# Altium schematic sheet Лист 1.SchDoc
size 420 x 297 mm; Scale: 1:1; Разраб.: Брюханов; Обозначение документа: АЛ.001.001 Э3; Номер листа: 1; Общее количество листов: 5; Масштаб: 1:1; Наименование организации: AlenLab; Наименование изделия 1: Плата; Наименование изделия 2: управления; Наименование изделия 3: Схема электрическая принципиальная; Нач. отд.: Нач. отд.
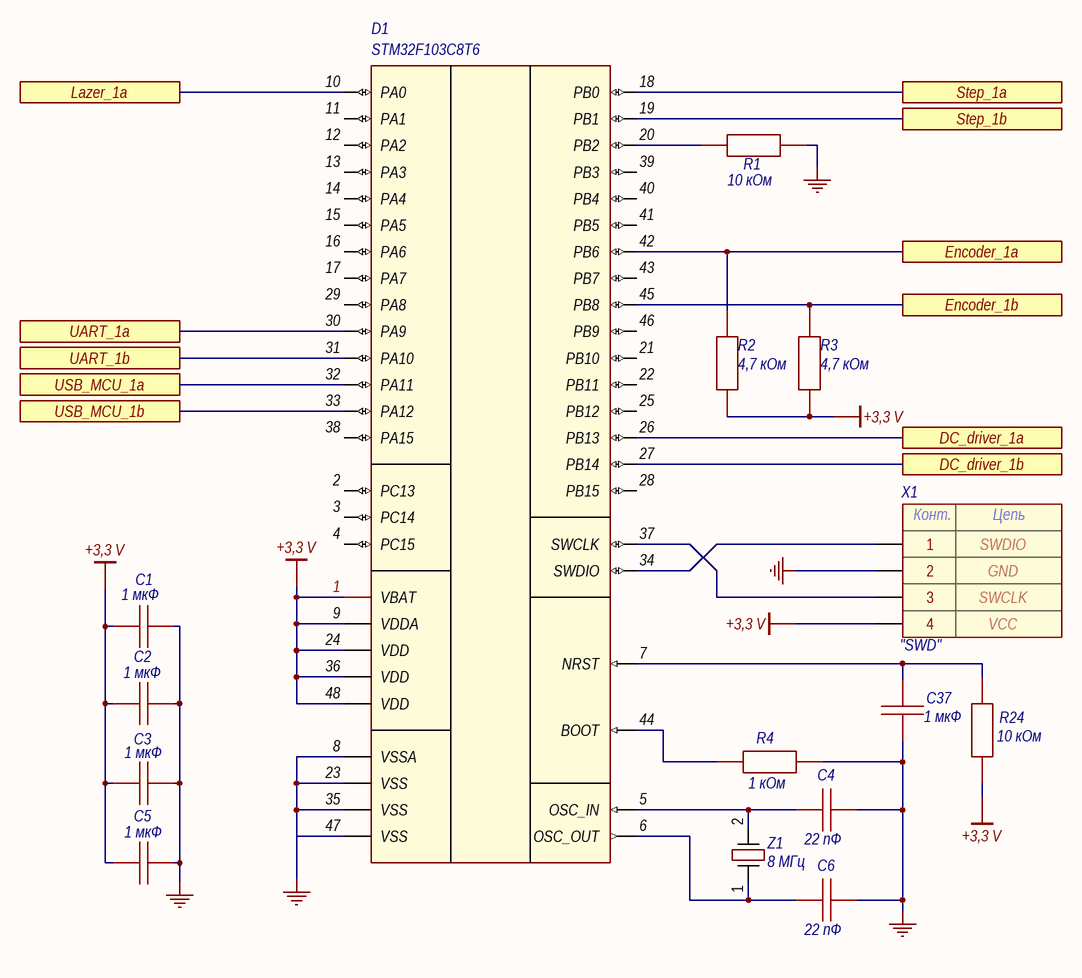
[diagram p0: Лист 1.SchDoc]

## Parts
C1  value 1 мкФ  [CAP: 0805]
C2  value 1 мкФ  [CAP: 0805]
C3  value 1 мкФ  [CAP: 0805]
C4  value 22 пФ  [CAP: 0805]
C5  value 1 мкФ  [CAP: 0805]
C6  value 22 пФ  [CAP: 0805]
C37  value 1 мкФ  [CAP: 0805]
D1  (no value)  [48-LQFP]
R1  value 10 кОм  [RES: 0805]
R2  value 4,7 кОм  [RES: 0805]
R3  value 4,7 кОм  [RES: 0805]
R4  value 1 кОм  [RES: 0805]
R24  value 10 кОм  [RES: 0805]
X1  CommentText: "SWD"  [CON: PLS-4]
Z1  8 МГц  [OSC: 5032 2 pin]

## Ports
DC_driver_1a, DC_driver_1b, Encoder_1a, Encoder_1b, Lazer_1a, Step_1a, Step_1b, UART_1a, UART_1b, USB_MCU_1a, USB_MCU_1b

## Nets
+3,3 V: C1.1 C2.1 C3.1 C5.1 D1.1(VBAT) D1.9(VDDA) D1.24(VDD) D1.36(VDD) D1.48(VDD) R2.1 R3.1 R24.1 X1.4
GND: C1.2 C2.2 C3.2 C4.1 C5.2 C6.1 C37.1 D1.8(VSSA) D1.23(VSS) D1.35(VSS) D1.47(VSS) R1.2 R4.2 X1.2
DC_driver_1a: D1.26(PB13) ; port DC_driver_1a
DC_driver_1b: D1.27(PB14) ; port DC_driver_1b
Encoder_1a: D1.42(PB6) R2.2 ; port Encoder_1a
Encoder_1b: D1.45(PB8) R3.2 ; port Encoder_1b
Lazer_1a: D1.10(PA0) ; port Lazer_1a
Step_1a: D1.18(PB0) ; port Step_1a
Step_1b: D1.19(PB1) ; port Step_1b
UART_1a: D1.30(PA9) ; port UART_1a
UART_1b: D1.31(PA10) ; port UART_1b
USB_MCU_1a: D1.32(PA11) ; port USB_MCU_1a
USB_MCU_1b: D1.33(PA12) ; port USB_MCU_1b
NetC4_2: C4.2 D1.5(OSC_IN) Z1.2
NetC6_2: C6.2 D1.6(OSC_OUT) Z1.1
NetC37_2: C37.2 D1.7(NRST) R24.2
NetD1_20: D1.20(PB2) R1.1
NetD1_34: D1.34(SWDIO) X1.1
NetD1_37: D1.37(SWCLK) X1.3
NetD1_44: D1.44(BOOT) R4.1

Not connected (* = marked no-connect by the designer): D1 2(PC13) 3(PC14) 4(PC15) 11(PA1) 12(PA2) 13(PA3) 14(PA4) 15(PA5) 16(PA6) 17(PA7) 21(PB10) 22(PB11) 25(PB12) 28(PB15) 29(PA8) 38(PA15) 39(PB3) 40(PB4) 41(PB5) 43(PB7) 46(PB9)

## Notes on the sheet
- Перв. примен.
- Справ. №
- Подп. и дата
- Инв. № дубл.
- Взам. инв. №
- Разраб.
- Изм.
- Лист
- № докум.
- Подп.
- Дата
- Лит.
- Масса
- Масштаб
- Пров.
- Т.контр.
- Листов
- Инв. № подл.
- Утв.
- Н.контр.
- Копировал
- Формат А3
- (in symbol PLS-4) Конт.; Цепь

## Library data of the parts
C1-C3 C5 = Ceramic_0805: Manufacturer: Yageo; PartNumber: CC0805KRX7R7BB104; ValueManufacturerPartNumber: Ceramic capacitor, 1 мкФ, X7R, ±10%, 16V, 0805, -55...+125°C; TypeCapacitor: Ceramic capacitor; Tolerance: ±10%; TypeDielectric: X7R; Voltage: 16V; Package: 0805; HelpURL: https://www.digikey.com/product-detail/en/yageo/CC0805KRX7R7BB104/311-1142-1-ND/303052; Temperature: -55...+125°C
C4 C6 = Ceramic_0805: Manufacturer: Yageo; PartNumber: CC0805KRX7R7BB104; ValueManufacturerPartNumber: Ceramic capacitor, 22 пФ, X7R, ±10%, 16V, 0805, -55...+125°C; TypeCapacitor: Ceramic capacitor; Tolerance: ±10%; TypeDielectric: X7R; Voltage: 16V; Package: 0805; HelpURL: https://www.digikey.com/product-detail/en/yageo/CC0805KRX7R7BB104/311-1142-1-ND/303052; Temperature: -55...+125°C
C37 = Ceramic_0805: Manufacturer: Yageo; PartNumber: CC0805KRX7R7BB104; ValueManufacturerPartNumber: Ceramic capacitor, 1 мкФ, X7R, ±10%, 16 В, 0805, -55...+125°C; TypeCapacitor: Ceramic capacitor; Tolerance: ±10%; TypeDielectric: X7R; Voltage: 16 В; Package: 0805; HelpURL: https://www.digikey.com/product-detail/en/yageo/CC0805KRX7R7BB104/311-1142-1-ND/303052; Temperature: -55...+125°C
D1 = STM32F103C8T6: Cortex-M3; Manufacturer: STMicroelectronics; ValueManufacturerPartNumber: IC microcontroller, 32-Bit, Cortex-M3, 72MHz, 64KB, 20KB, 2...3.6V, -40...+85°C, 48-LQFP; Supply: 2...3.6V; Speed: 72MHz; CoreSize: 32-Bit; MemoryROM: 64KB; MemoryRAM: 20KB; HelpURL: https://www.digikey.com/product-detail/en/stmicroelectronics/STM32F103C8T6TR/497-17666-1-ND/7804402; Package: 48-LQFP; ComponentType: IC microcontroller; Temperature: -40...+85°C; CoreProcessor: Cortex-M3; PartNumber: STM32F103C8T6
R1 R24 = Resistor_0805: Manufacturer: Yageo; PartNumber: RC0805JR-07100RL; ValueManufacturerPartNumber: Resistor film, 10 кОм, ±5%, 0805, 0.125W, -55...+125°C; TypeResistor: Resistor film; Power: 0.125W; Tolerance: ±5%; Package: 0805; HelpURL: https://www.digikey.com/product-detail/en/yageo/RC0805JR-07100RL/311-100ARCT-ND/731185; Temperature: -55...+125°C
R2 R3 = Resistor_0805: Manufacturer: Yageo; PartNumber: RC0805JR-07100RL; ValueManufacturerPartNumber: Resistor film, 4,7 кОм, ±5%, 0805, 0.125W, -55...+125°C; TypeResistor: Resistor film; Power: 0.125W; Tolerance: ±5%; Package: 0805; HelpURL: https://www.digikey.com/product-detail/en/yageo/RC0805JR-07100RL/311-100ARCT-ND/731185; Temperature: -55...+125°C
R4 = Resistor_0805: Manufacturer: Yageo; PartNumber: RC0805JR-07100RL; ValueManufacturerPartNumber: Resistor film, 1 кОм, ±5%, 0805, 0.125W, -55...+125°C; TypeResistor: Resistor film; Power: 0.125W; Tolerance: ±5%; Package: 0805; HelpURL: https://www.digikey.com/product-detail/en/yageo/RC0805JR-07100RL/311-100ARCT-ND/731185; Temperature: -55...+125°C
X1 = PLS-4: Manufacturer: Connfly; ValueManufacturerPartNumber: Connector, 4pin, 2.54mm, 500VAC, 3A; TypeConnector: Connector; VoltageMax: 500VAC; Pitch: 2.54mm; CurrentMax: 3A; Multichannel: 4pin; Pin1: SWDIO; Pin2: GND; Pin3: SWCLK; Pin4: VCC; HelpURL: https://www.chipdip.ru/product/pls-4; PartNumber: PLS-4
Z1 = Crystal_5032_2_pin: NX5032GA-8MHz,                8 МГц,                                 30/20ppm,                        8пФ,                                 -40...+85°C,                SMD 5.0*3.2*1.3мм; Package: Case 5032